# Altium schematic sheet WirelessConnectivity.SchDoc
size 381 x 241 mm
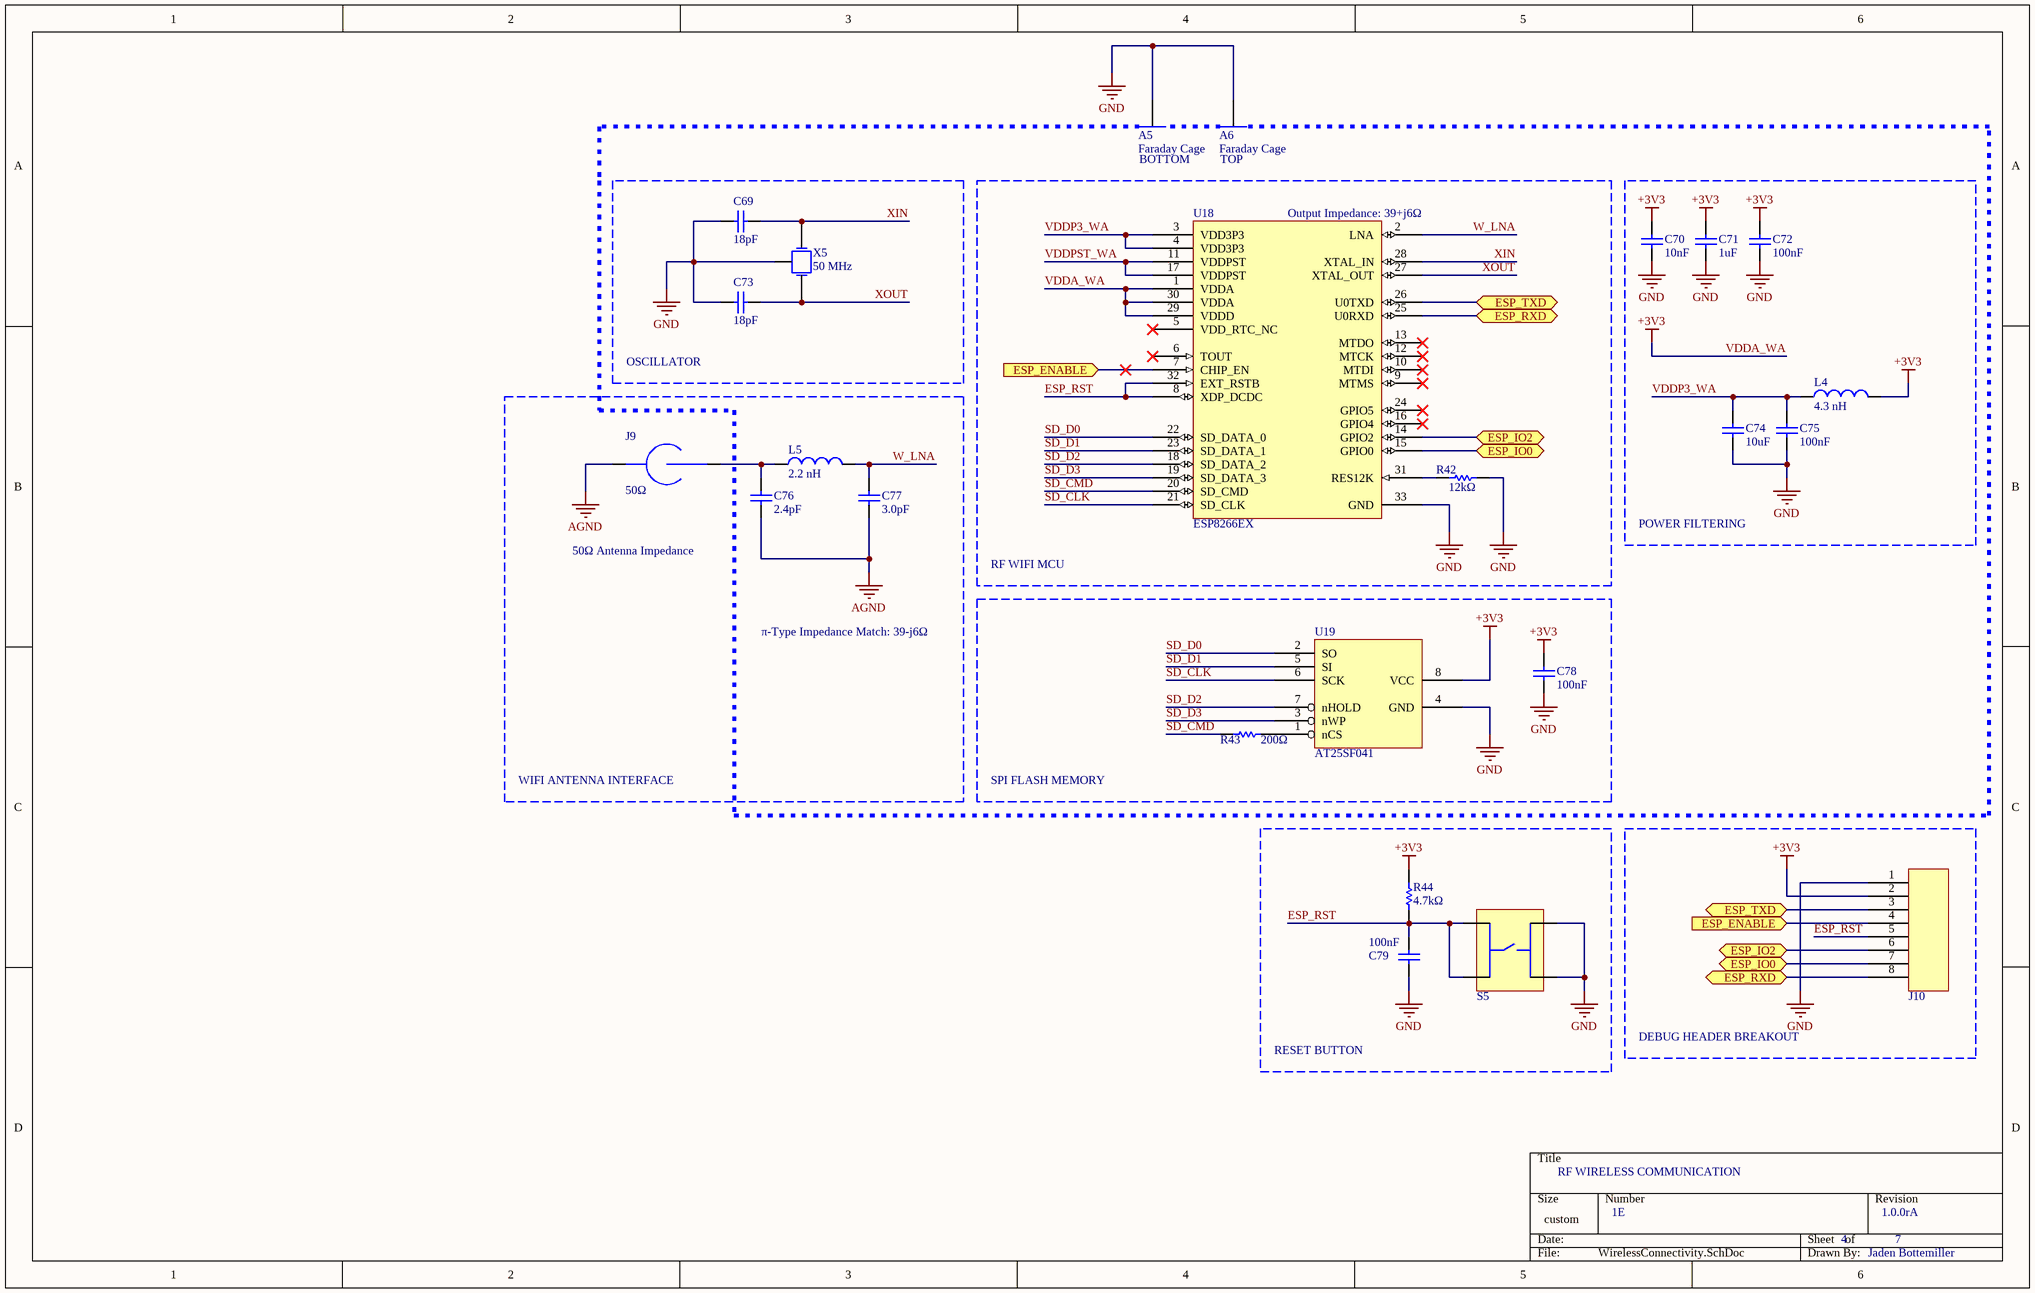
[diagram p0: WirelessConnectivity.SchDoc]

## Parts
A5  Faraday Cage
A6  Faraday Cage
C69  value 18pF  (hidden comment: CAP)
C70  value 10nF  (hidden comment: CAP)
C71  value 1uF  (hidden comment: CAP)
C72  value 100nF  (hidden comment: CAP)
C73  value 18pF  (hidden comment: CAP)
C74  value 10uF  (hidden comment: CAP)
C75  value 100nF  (hidden comment: CAP)
C76  value 2.4pF  (hidden comment: CAP)
C77  value 3.0pF  (hidden comment: CAP)
C78  value 100nF  (hidden comment: CAP)
C79  value 100nF  (hidden comment: CAP)
J9  Impedance: 50Ω  (hidden comment: Coaxial Connection)
J10  8 Pin Connector  (value not drawn)
L4  value 4.3 nH  (hidden comment: IND)
L5  value 2.2 nH  (hidden comment: IND)
R42  value 12kΩ  (hidden comment: RES)
R43  value 200Ω  (hidden comment: RES)
R44  value 4.7kΩ  (hidden comment: RES)
S5  Pushbutton  (value not drawn)
U18  ESP8266EX
U19  AT25SF041
X5  value 50 MHz  (hidden comment: Crystal Oscillator)

## Blocks framed on the sheet
OSCILLATOR: C69 C73 X5
POWER FILTERING: C70-C72 C74 C75 L4
SPI FLASH MEMORY: C78 R43 U19
RESET BUTTON: C79 R44 S5
DEBUG HEADER BREAKOUT: J10

## Ports
ESP_ENABLE (in), ESP_IO0 (bidir), ESP_IO2 (bidir), ESP_RXD (bidir), ESP_TXD (bidir)

## Nets
AGND: C76.1 C77.1 J9.2
GND: A5.1(Pin) A6.1(Pin) C69.2 C70.1 C71.1 C72.1 C73.2 C74.1 C75.1 C78.1 C79.1 J10.1(Pin) R42.2 S5.3(Pin) S5.4(Pin) U18.33(GND) U19.4(GND) X5.3(GND)
VDDA_WA: C70.2 C71.2 C72.2 C78.2 J10.2(Pin) L4.2 R44.2 U18.1(VDDA) U18.29(VDDD) U18.30(VDDA) U19.8(VCC)  [also labelled +3V3]
ESP_ENABLE: J10.4(Pin) U18.7(CHIP_EN) ; port ESP_ENABLE
ESP_IO0: J10.7(Pin) U18.15(GPIO0) ; port ESP_IO0
ESP_IO2: J10.6(Pin) U18.14(GPIO2) ; port ESP_IO2
ESP_RST: C79.2 J10.5(Pin) R44.1 S5.1 S5.2(Pin) U18.8(XDP_DCDC) U18.32(EXT_RSTB)
ESP_RXD: J10.8(Pin) U18.25(U0RXD) ; port ESP_RXD
ESP_TXD: J10.3(Pin) U18.26(U0TXD) ; port ESP_TXD
SD_CLK: U18.21(SD_CLK) U19.6(SCK)
SD_CMD: R43.1 U18.20(SD_CMD)
SD_D0: U18.22(SD_DATA_0) U19.2(SO)
SD_D1: U18.23(SD_DATA_1) U19.5(SI)
SD_D2: U18.18(SD_DATA_2) U19.7(nHOLD)
SD_D3: U18.19(SD_DATA_3) U19.3(nWP)
VDDP3_WA: C74.2 C75.2 L4.1 U18.3(VDD3P3) U18.4(VDD3P3)
VDDPST_WA: U18.11(VDDPST) U18.17(VDDPST)
W_LNA: C77.2 L5.2 U18.2(LNA)
XIN: C69.1 U18.28(XTAL_IN) X5.1(X1)
XOUT: C73.1 U18.27(XTAL_OUT) X5.2(X2)
NetC76_2: C76.2 J9.1(Pin) L5.1
NetR42_1: R42.1 U18.31(RES12K)
NetR43_2: R43.2 U19.1(nCS)

Not connected (* = marked no-connect by the designer): U18 5(VDD_RTC_NC)* 6(TOUT)* 9(MTMS)* 10(MTDI)* 12(MTCK)* 13(MTDO)* 16(GPIO4)* 24(GPIO5)*

## Notes on the sheet
- (near A5) BOTTOM
- (near A6) TOP
- (near U18) Output Impedance: 39+j6Ω
- 50Ω Antenna Impedance
- RF WIFI MCU
- π-Type Impedance Match: 39-j6Ω
- WIFI ANTENNA INTERFACE
- RF WIRELESS COMMUNICATION
- 1E
- 4
- 1.0.0rA
- 7
- Jaden Bottemiller

## Library data of the parts
A5 A6 = Faraday Cage: Standard Faraday Cage
C69-C79 = CAP: Standard Capacitor
J9 = COAX: Coaxial Connection, e.g. to antennae
J10 = CONN_8PIN: Standard 8 Pin Connector
L4 L5 = IND: Standard Inductor
R42 R44 = RES: Standard Resistor; Tolerance: 1%
R43 = RES: Standard Resistor
S5 = PUSHBTN_4T: Standard Pushbutton with 4 Terminals
U18 = ESP8266EX: IC RF TxRx + MCU WiFi 802.11b/g/n 2.4GHz; ComponentLink1Description: DigiKey; ComponentLink1URL: https://www.digikey.com/product-detail/en/espressif-systems/ESP8266EX/1904-1001-1-ND/8028408; ComponentLink2Description: Datasheet; ComponentLink2URL: https://www.espressif.com/sites/default/files/documentation/0a-esp8266ex_datasheet_en.pdf
U19 = AT25SF041: FLASH Memory IC 4Mb (512K x 8) SPI 104MHz  8-SOIC; ComponentLink1Description: DigiKey; ComponentLink1URL: https://www.digikey.com/product-detail/en/active-semi-international-inc/ACT4060ASH-T/1488-1107-1-ND/7897251; ComponentLink2Description: Datasheet; ComponentLink2URL: https://active-semi.com/wp-content/uploads/ACT4060A_Datasheet.pdf
X5 = OSC_1GND: Standard Crystal Oscillator with a ground connection.